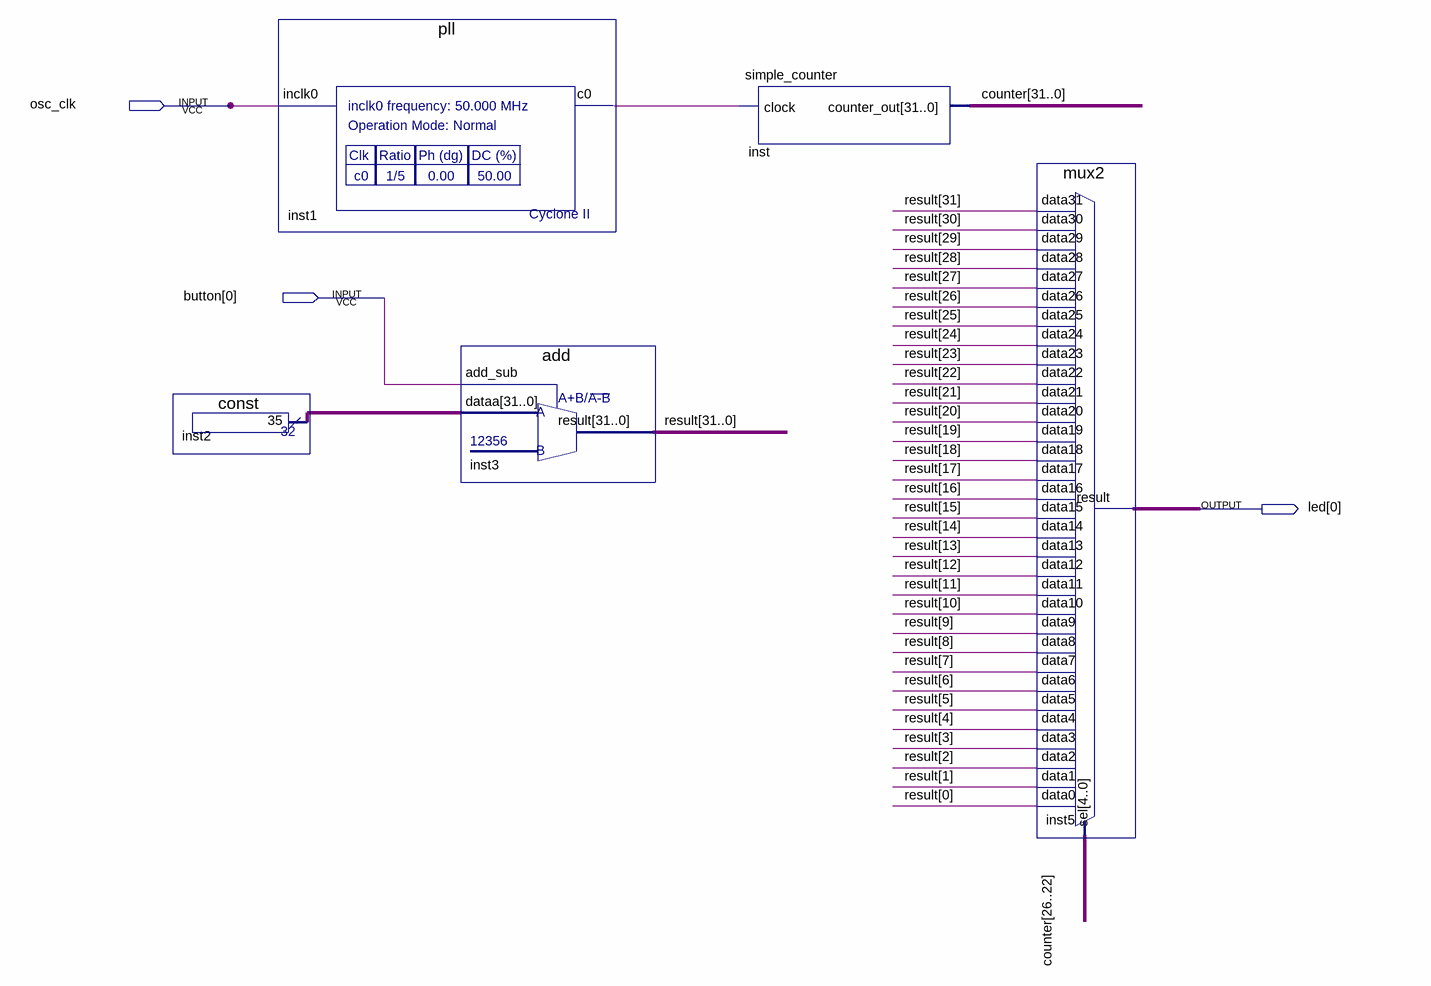
[diagram p0: schematic sheet]
// Quartus schematic test.bdf as structural Verilog: 5 symbols, 3 pins
module test (
  input  osc_clk,
  input  [0:0] button,
  output [0:0] led
);

  wire inst1_c0;
  wire [31:0] counter, inst2_result, result;

  \const  inst2 (.result(inst2_result));
  pll inst1 (.inclk0(osc_clk), .c0(inst1_c0));
  add inst3 (.add_sub(button[0]), .dataa(inst2_result), .result(result));
  simple_counter inst (.clock(inst1_c0), .counter_out(counter));
  mux2 inst5 (
    .data31(result[31]), .data30(result[30]), .data29(result[29]), .data28(result[28]), .data27(result[27]),
    .data26(result[26]), .data25(result[25]), .data24(result[24]), .data23(result[23]), .data22(result[22]),
    .data21(result[21]), .data20(result[20]), .data19(result[19]), .data18(result[18]), .data17(result[17]),
    .data16(result[16]), .data15(result[15]), .data14(result[14]), .data13(result[13]), .data12(result[12]),
    .data11(result[11]), .data10(result[10]), .data9(result[9]), .data8(result[8]), .data7(result[7]),
    .data6(result[6]), .data5(result[5]), .data4(result[4]), .data3(result[3]), .data2(result[2]),
    .data1(result[1]), .data0(result[0]), .sel(counter[26:22]), .result(led[0]));
endmodule
